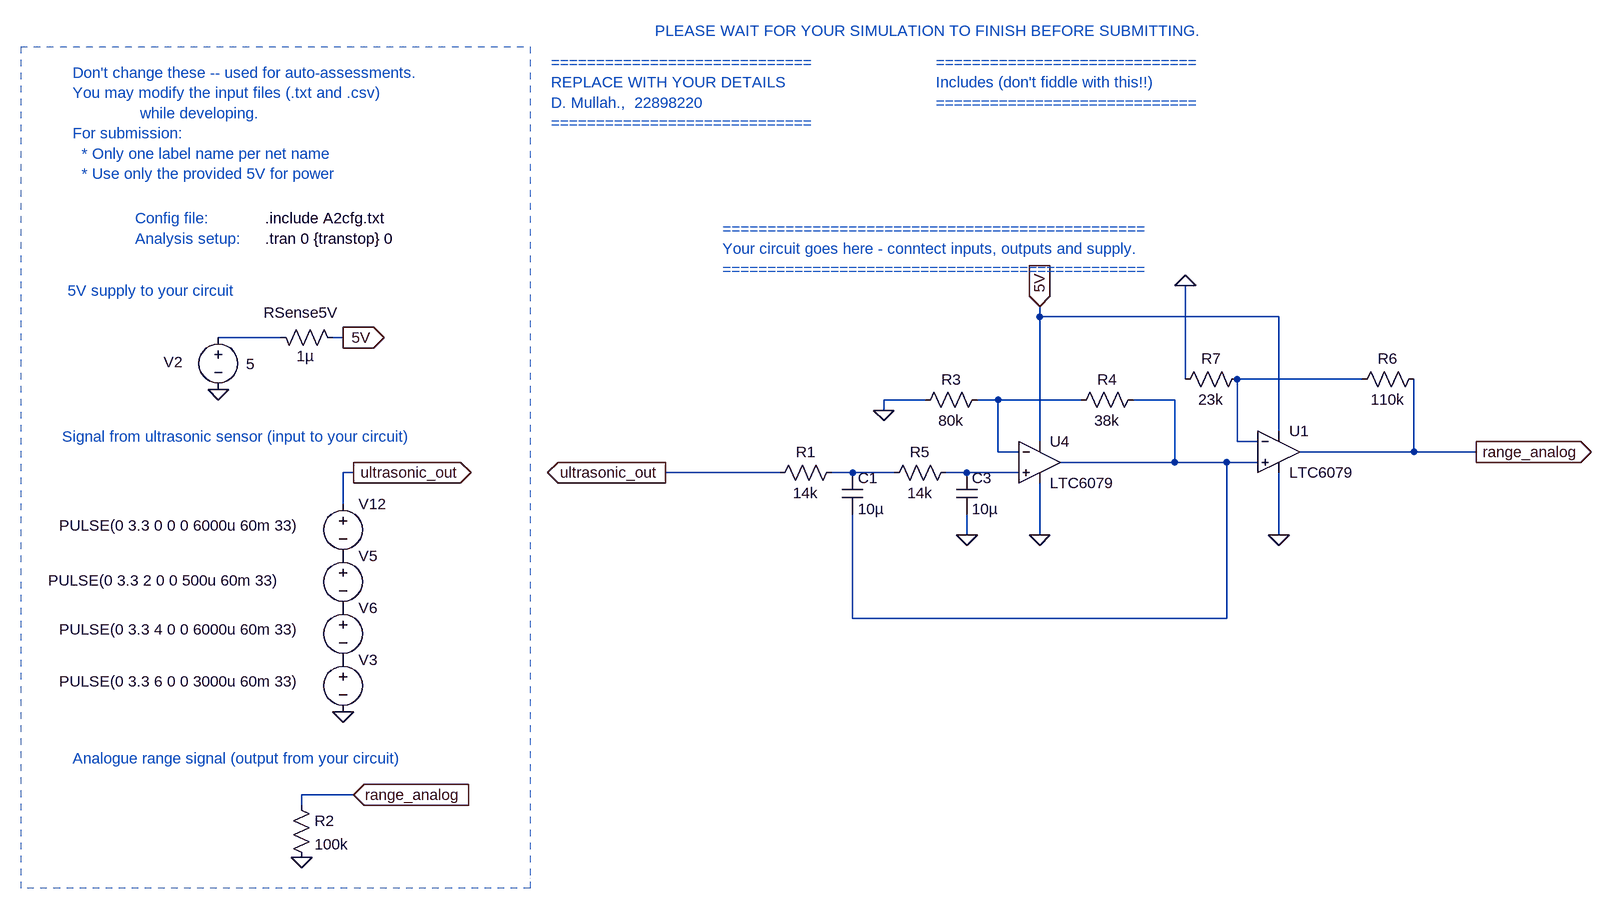
[diagram p0: schematic E344_Ass2_US2A.asc]
E344_Ass2_US2A.asc, the LTspice schematic file:
Version 4
SHEET 1 3140 2124
WIRE -800 -1008 -800 -1024
WIRE -432 -1008 -800 -1008
WIRE -1968 -976 -2064 -976
WIRE -1872 -976 -1888 -976
WIRE -576 -912 -576 -1056
WIRE -304 -912 -496 -912
WIRE -976 -880 -1040 -880
WIRE -864 -880 -896 -880
WIRE -736 -880 -864 -880
WIRE -592 -880 -656 -880
WIRE -1040 -864 -1040 -880
WIRE -432 -832 -432 -1008
WIRE -800 -816 -800 -1008
WIRE -496 -816 -496 -912
WIRE -464 -816 -496 -816
WIRE -864 -800 -864 -880
WIRE -832 -800 -864 -800
WIRE -224 -800 -224 -912
WIRE -224 -800 -400 -800
WIRE -128 -800 -224 -800
WIRE -592 -784 -592 -880
WIRE -592 -784 -768 -784
WIRE -512 -784 -592 -784
WIRE -464 -784 -512 -784
WIRE -1856 -768 -1872 -768
WIRE -1200 -768 -1376 -768
WIRE -1088 -768 -1120 -768
WIRE -1024 -768 -1088 -768
WIRE -912 -768 -944 -768
WIRE -832 -768 -912 -768
WIRE -1872 -720 -1872 -768
WIRE -912 -672 -912 -704
WIRE -800 -672 -800 -752
WIRE -432 -672 -432 -768
WIRE -1088 -544 -1088 -704
WIRE -512 -544 -512 -784
WIRE -512 -544 -1088 -544
WIRE -1856 -272 -1936 -272
WIRE -1936 -256 -1936 -272
FLAG -1872 -976 5V
IOPIN -1872 -976 Out
FLAG -2064 -896 0
FLAG -800 -1024 5V
IOPIN -800 -1024 In
FLAG -1872 -400 0
FLAG -1856 -768 ultrasonic_out
IOPIN -1856 -768 Out
FLAG -1376 -768 ultrasonic_out
IOPIN -1376 -768 Out
FLAG -128 -800 range_analog
IOPIN -128 -800 Out
FLAG -1856 -272 range_analog
IOPIN -1856 -272 In
FLAG -1936 -176 0
FLAG -1040 -864 0
FLAG -800 -672 0
FLAG -912 -672 0
FLAG -432 -672 0
FLAG -576 -1056 0
SYMBOL voltage -2064 -992 R0
WINDOW 123 0 0 Left 0
WINDOW 39 0 0 Left 0
WINDOW 0 -84 54 Left 2
WINDOW 3 43 57 Left 2
SYMATTR InstName V2
SYMATTR Value 5
SYMBOL res -1984 -992 M90
WINDOW 0 -7 47 VBottom 2
WINDOW 3 29 54 VTop 2
SYMATTR InstName RSense5V
SYMATTR Value 1µ
SYMBOL Opamps\\LTC6079 -800 -784 R0
SYMATTR InstName U4
SYMBOL voltage -1872 -736 R0
WINDOW 123 0 0 Left 0
WINDOW 39 0 0 Left 0
WINDOW 3 -437 49 Left 2
SYMATTR Value PULSE(0 3.3 0 0 0 6000u 60m 33)
SYMATTR InstName V12
SYMBOL voltage -1872 -656 R0
WINDOW 123 0 0 Left 0
WINDOW 39 0 0 Left 0
WINDOW 3 -454 54 Left 2
SYMATTR Value PULSE(0 3.3 2 0 0 500u 60m 33)
SYMATTR InstName V5
SYMBOL voltage -1872 -576 R0
WINDOW 123 0 0 Left 0
WINDOW 39 0 0 Left 0
WINDOW 3 -437 49 Left 2
SYMATTR Value PULSE(0 3.3 4 0 0 6000u 60m 33)
SYMATTR InstName V6
SYMBOL voltage -1872 -496 R0
WINDOW 123 0 0 Left 0
WINDOW 39 0 0 Left 0
WINDOW 3 -437 49 Left 2
SYMATTR Value PULSE(0 3.3 6 0 0 3000u 60m 33)
SYMATTR InstName V3
SYMBOL res -1952 -272 R0
SYMATTR InstName R2
SYMATTR Value 100k
SYMBOL res -1104 -784 R90
WINDOW 0 0 56 VBottom 2
WINDOW 3 32 56 VTop 2
SYMATTR InstName R1
SYMATTR Value 14k
SYMBOL cap -1104 -768 R0
SYMATTR InstName C1
SYMATTR Value 10µ
SYMBOL res -880 -896 R90
WINDOW 0 0 56 VBottom 2
WINDOW 3 32 56 VTop 2
SYMATTR InstName R3
SYMATTR Value 80k
SYMBOL res -640 -896 R90
WINDOW 0 0 56 VBottom 2
WINDOW 3 32 56 VTop 2
SYMATTR InstName R4
SYMATTR Value 38k
SYMBOL res -928 -784 R90
WINDOW 0 0 56 VBottom 2
WINDOW 3 32 56 VTop 2
SYMATTR InstName R5
SYMATTR Value 14k
SYMBOL cap -928 -768 R0
SYMATTR InstName C3
SYMATTR Value 10µ
SYMBOL Opamps\\LTC6079 -432 -800 R0
SYMATTR InstName U1
SYMBOL res -208 -928 R90
WINDOW 0 0 56 VBottom 2
WINDOW 3 32 56 VTop 2
SYMATTR InstName R6
SYMATTR Value 110k
SYMBOL res -480 -928 R90
WINDOW 0 0 56 VBottom 2
WINDOW 3 32 56 VTop 2
SYMATTR InstName R7
SYMATTR Value 23k
TEXT -1992 -1128 Left 2 !.tran 0 {transtop} 0
TEXT -1992 -1160 Left 2 !.include A2cfg.txt
TEXT -2288 -1384 Left 2 ;Don't change these -- used for auto-assessments.\nYou may modify the input files (.txt and .csv) \n               while developing.\nFor submission: \n  * Only one label name per net name\n  * Use only the provided 5V for power
TEXT -2192 -1160 Left 2 ;Config file:
TEXT -2192 -1128 Left 2 ;Analysis setup:
TEXT -1552 -1400 Left 2 ;=============================\nREPLACE WITH YOUR DETAILS\nD. Mullah.,  22898220\n=============================
TEXT -960 -1400 Left 2 ;=============================\nIncludes (don't fiddle with this!!)\n=============================
TEXT -1288 -1144 Left 2 ;===============================================\nYour circuit goes here - conntect inputs, outputs and supply.\n===============================================
TEXT -1392 -1448 Left 2 ;PLEASE WAIT FOR YOUR SIMULATION TO FINISH BEFORE SUBMITTING.
TEXT -2304 -824 Left 2 ;Signal from ultrasonic sensor (input to your circuit)
TEXT -2296 -1048 Left 2 ;5V supply to your circuit
TEXT -2288 -328 Left 2 ;Analogue range signal (output from your circuit)
LINE Normal -1584 -1424 -1584 -128 2
LINE Normal -2368 -1424 -1584 -1424 2
LINE Normal -1584 -128 -2368 -128 2
LINE Normal -1584 -144 -1584 -144 2
LINE Normal -2368 -1424 -2368 -128 2

The netlist it stands for:
* E344_Ass2_US2A.asc
V2 N001 0 5
RSense5V N001 5V 1µ
XU4 N006 N003 5V 0 N004 LTC6078  ; LTC6079, pins In+ In- V+ V- OUT
V12 ultrasonic_out P001 PULSE(0 3.3 0 0 0 6000u 60m 33)
V5 P001 P002 PULSE(0 3.3 2 0 0 500u 60m 33)
V6 P002 P003 PULSE(0 3.3 4 0 0 6000u 60m 33)
V3 P003 0 PULSE(0 3.3 6 0 0 3000u 60m 33)
R2 range_analog 0 100k
R1 N005 ultrasonic_out 14k
C1 N005 N004 10µ
R3 N003 0 80k
R4 N004 N003 38k
R5 N006 N005 14k
C3 N006 0 10µ
XU1 N004 N002 5V 0 range_analog LTC6078  ; LTC6079, pins In+ In- V+ V- OUT
R6 range_analog N002 110k
R7 N002 0 23k
.tran 0 {transtop} 0
.include A2cfg.txt
* Don't change these -- used for auto-assessments.
* You may modify the input files (.txt and .csv)
*                while developing.
* For submission:
*   * Only one label name per net name
*   * Use only the provided 5V for power
* Config file:
* Analysis setup:
* =============================
* REPLACE WITH YOUR DETAILS
* D. Mullah.,  22898220
* =============================
* =============================
* Includes (don't fiddle with this!!)
* =============================
* ===============================================
* Your circuit goes here - conntect inputs, outputs and supply.
* ===============================================
* PLEASE WAIT FOR YOUR SIMULATION TO FINISH BEFORE SUBMITTING.
* Signal from ultrasonic sensor (input to your circuit)
* 5V supply to your circuit
* Analogue range signal (output from your circuit)
.lib LTC5.lib
.backanno
.end